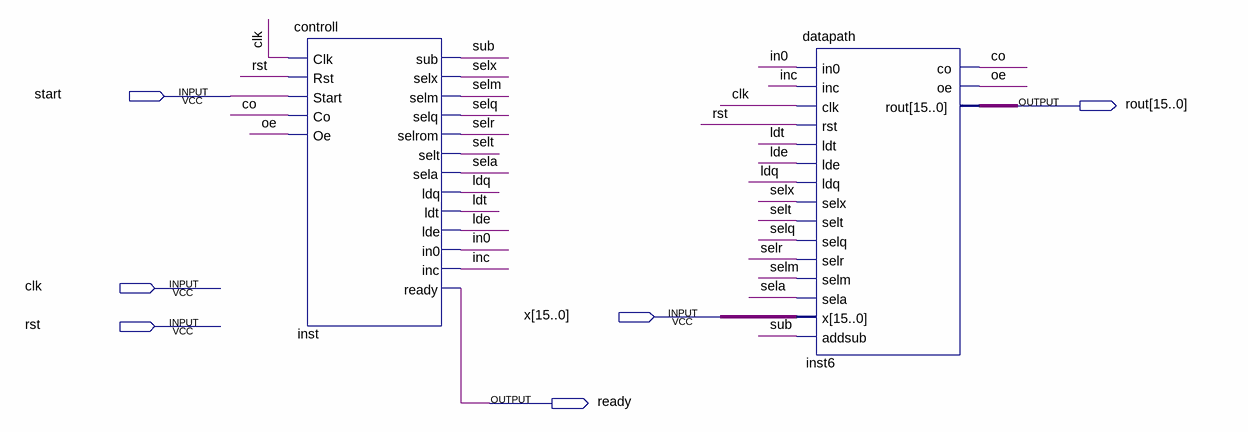
[diagram p0: schematic sheet]
// Quartus schematic tanhcal.bdf as structural Verilog: 2 symbols, 6 pins
module tanhcal (
  input  start,
  input  clk,
  input  [15:0] x,
  input  rst,
  output [15:0] rout,
  output ready
);

  wire co, in0, inc, lde, ldq, ldt, oe, sela, selm, selq, selr, selt, selx, sub;

  controll inst (
    .Clk(clk), .Rst(rst), .Start(start), .Co(co), .Oe(oe), .sub(sub), .selx(selx), .selm(selm), .selq(selq),
    .selrom(selr), .selt(selt), .sela(sela), .ldq(ldq), .ldt(ldt), .lde(lde), .in0(in0), .inc(inc),
    .ready(ready));
  datapath inst6 (
    .in0(in0), .inc(inc), .clk(clk), .rst(rst), .ldt(ldt), .lde(lde), .ldq(ldq), .selx(selx), .selt(selt),
    .selq(selq), .selr(selr), .selm(selm), .sela(sela), .x(x), .addsub(sub), .co(co), .oe(oe), .rout(rout));
endmodule
